# EAGLE design ambisoniqueAlim (EAGLE 7.6.0)
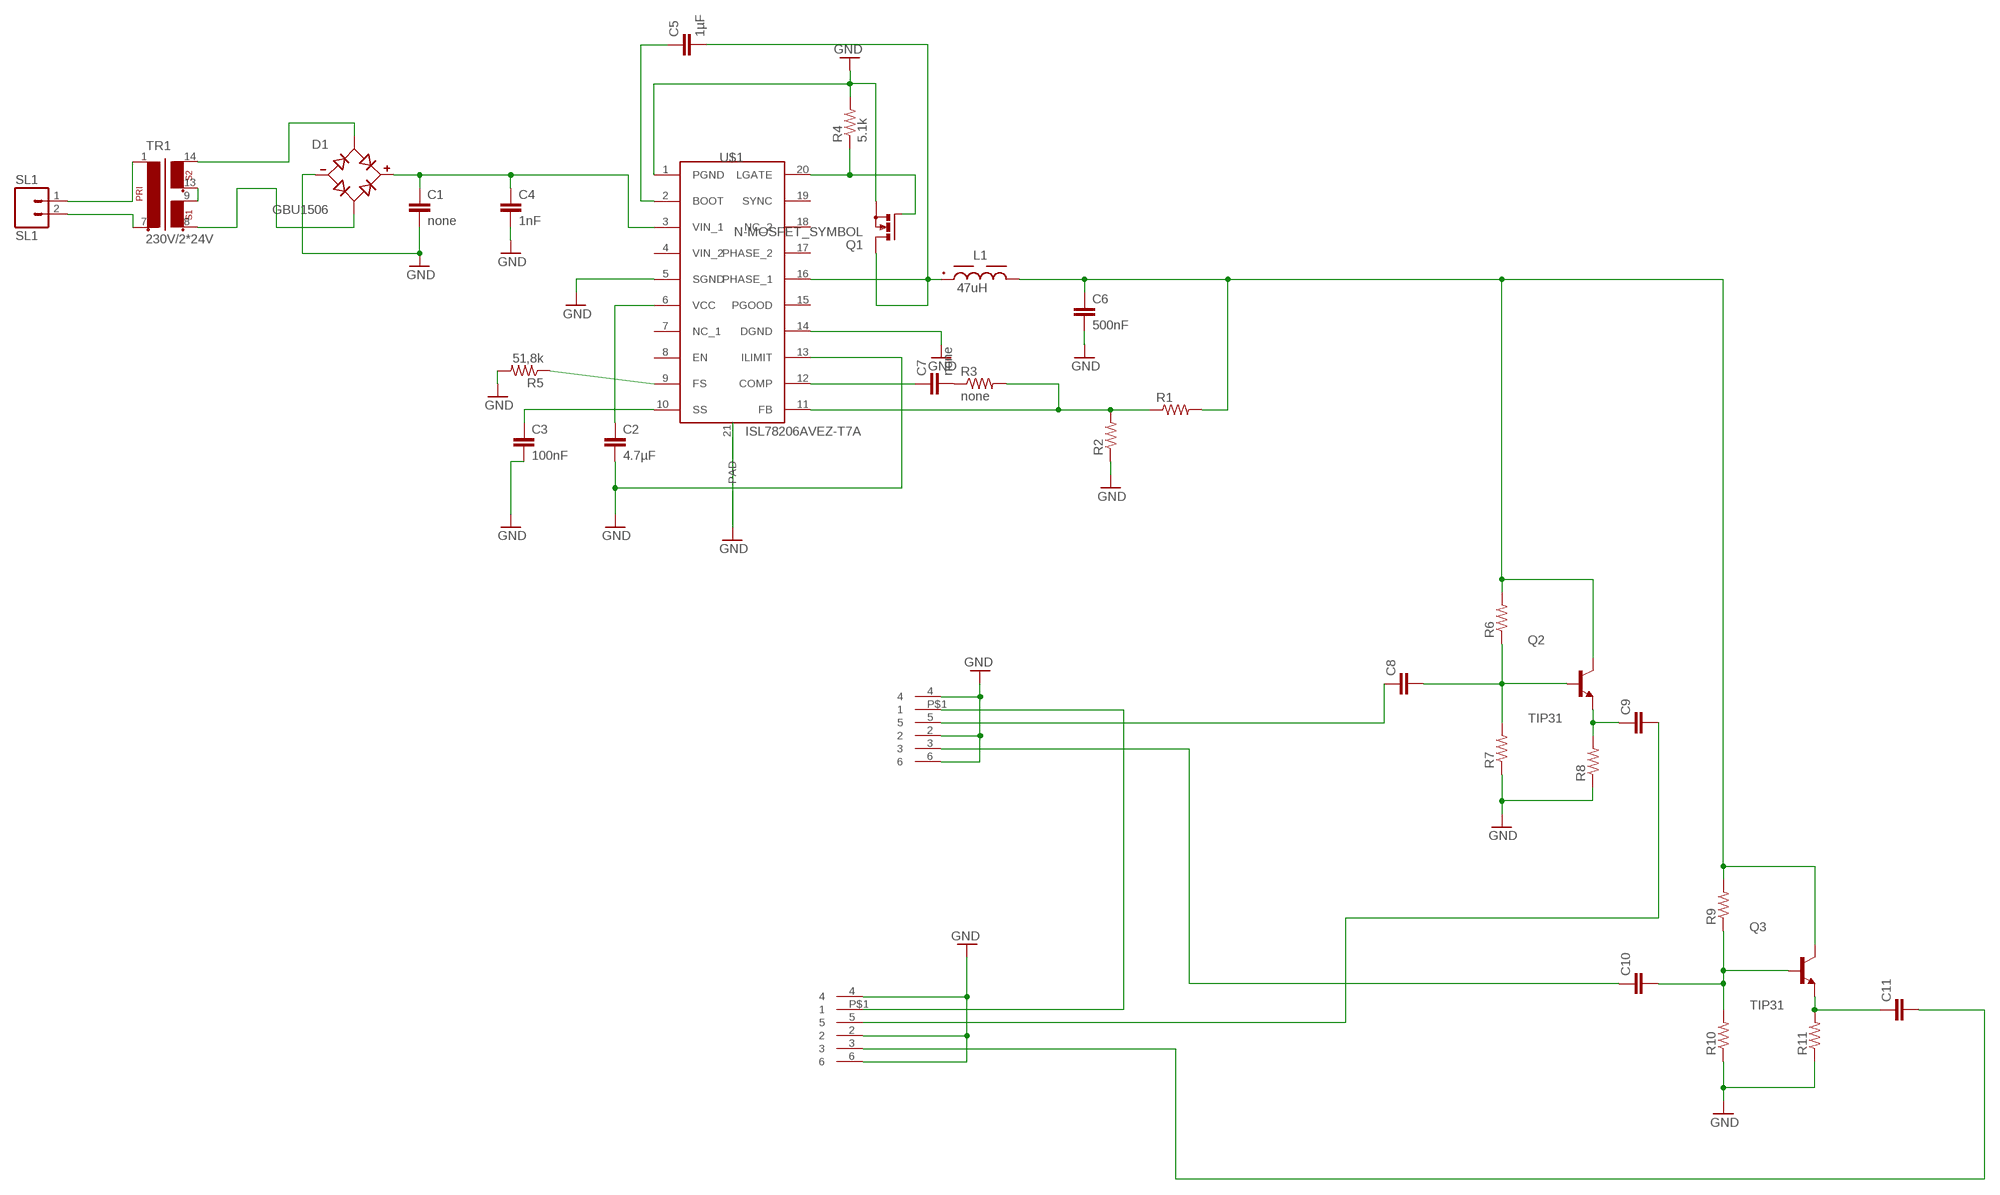
[diagram p0: schematic, sheet 1]

## Parts
C1  none  C-EUC0603  [C0603]
C2  4.7µF  C-EUC0603  [C0603]
C3  100nF  C-EUC0603  [C0603]
C4  1nF  C-EUC0603  [C0603]
C5  1µF  C-EUC0603  [C0603]
C6  500nF  C-EUC0603  [C0603]
C7  none  C-EUC0603  [C0603]
C8  C-EUC0603  [C0603]
C9  C-EUC0603  [C0603]
C10  C-EUC0603  [C0603]
C11  C-EUC0603  [C0603]
D1  GBU1506  [SIP343W114P508L2205H2134Q4]
L1  47uH  WE-PDA_1210_7847709470  [WE-PDA_1210]
Q2  TIP31  [TO254P1060X482X2222-3]
Q3  TIP31  [TO254P1060X482X2222-3]
R1  R-US_R0603  [R0603]
R2  R-US_R0603  [R0603]
R3  none  R-US_R0603  [R0603]
R4  5.1k  R-US_R0603  [R0603]
R5  51,8k  R-US_R0603  [R0603]
R6  R-US_R0603  [R0603]
R7  R-US_R0603  [R0603]
R8  R-US_R0603  [R0603]
R9  R-US_R0603  [R0603]
R10  R-US_R0603  [R0603]
R11  R-US_R0603  [R0603]
SL1  SL1  M02  [02P]
TR1  230V/2*24V  EI60-2  [EI60-2]
U$1  ISL78206AVEZ-T7A  [SOP65P640X110-21N]
U$2  JACK6.35MMRSPRODEV  [JACKRSPRO6.35MM]
U$3  JACK6.35MMRSPRODEV  [JACKRSPRO6.35MM]

## Nets
GND: C1.2 C2.2 C3.2 C4.2 C6.2 D1.- R2.1 R4.2 R5.2 R7.1 R8.1 R10.1 R11.1 U$1.1(PGND) U$1.5(SGND) U$1.13(ILIMIT) U$1.14(DGND) U$1.21(PAD) U$2.2 U$2.4 U$2.6 U$3.2 U$3.4 U$3.6
N$1: TR1.9 TR1.13
N$2: D1.AC1 TR1.14
N$3: C2.1 U$1.6(VCC)
N$4: SL1.1 TR1.1
N$5: SL1.2 TR1.7
N$6: D1.AC2 TR1.8
N$7: U$2.P$1 U$3.P$1
N$8: C1.1 C4.1 D1.+ U$1.3(VIN_1)
N$9: C3.1 U$1.10(SS)
N$10: C5.1 U$1.2(BOOT)
N$11: C10.2 Q3.1(B) R9.1 R10.2
N$12: C9.1 Q2.3(E) R8.2
N$13: R1.1 R2.2 R3.2 U$1.11(FB)
N$14: C7.1 U$1.12(COMP)
N$15: C7.2 R3.1
N$16: R5.1 U$1.9(FS)
N$17: R4.1 U$1.20(LGATE)
N$18: C8.2 Q2.1(B) R6.1 R7.2
N$19: C9.2 U$3.5
N$20: C11.1 Q3.3(E) R11.2
N$21: C6.1 L1.2 Q2.2(C) Q3.2(C) R1.2 R6.2 R9.2
N$22: C5.2 L1.1 U$1.16(PHASE_1)
N$23: C11.2 U$3.3
N$24: C10.1 U$2.3
N$25: C8.1 U$2.5
Unconnected: U$1.4(VIN_2) U$1.7(NC_1) U$1.8(EN) U$1.15(PGOOD) U$1.17(PHASE_2) U$1.18(NC_2) U$1.19(SYNC)

## Library data of the parts
C1-C11 = rcl:C-EU: CAPACITOR, European symbol
D1 = GBU1506:GBU1506: Check availability <https://pricing.snapeda.com/parts/GBU1506/Taiwan%20Semiconductor%20Corporation/view-part?ref=eda>; AVAILABILITY: In Stock; DESCRIPTION: 15A, 800V, Standard Bridge Rectifier; MF: Taiwan Semiconductor Corporation; MP: GBU1506; PACKAGE: GBU Taiwan Semiconductor; PRICE: None
L1 = Eagle_WE-PDA (rev20b):WE-PDA_1210: WE-PDA SMD Shielded Power Inductor Characteristics Magnetically shielded version which results in a low leakage field High storage capacity High Saturation currents up to 23 A Very low self-losses at high switching frequency's Wide inductance spectrum available at all sizes Operating Temperature -40 °C up to +125 °C Core Material: NiZn Wire connection: welding technology Applications Multimedia applications Switching regulators with low operating voltages Integrated DC/DC-converter Perfect suitable for switching regulators with extremely high efficiency (> 86 %) Plastic base: Because of the one piece construction these are more suitable for high vibration or shock applications <https://www.we-online.com/catalog/media/o55118v209%20Family_WE-PDA.jpg> Details see: https://www.we-online.com/katalog/en/WE-PDA Updated by Ella Wu 2020-03-18 2020(C) Wurth Elektronik; DATASHEET-URL: https://www.we-online.com/catalog/datasheet/7847709470.pdf; FRES: 6.3MHz; IR: 3.2A; ISAT: 3.5A; MOUNT: SMT; PART-NUMBER: 7847709470; RDC-MAX: 67mOhm; RDC-TYP: 56mOhm
Q2 Q3 = TIP31:TIP31: Bipolar (BJT) Transistor NPN 40V 3A 3MHz 2W Through Hole TO-220AB Check availability <https://pricing.snapeda.com/parts/TIP31/ON/view-part?ref=eda>; AVAILABILITY: In Stock; DESCRIPTION: Bipolar (BJT) Transistor NPN 100 V 3 A 3MHz 2 W Through Hole TO-220; MF: ON; MP: TIP31; PACKAGE: TO-220-3 ON Semiconductor; PRICE: None; PURCHASE-URL: https://pricing.snapeda.com/search/part/TIP31/?ref=eda
R1-R11 = rcl:R-US_: RESISTOR, American symbol
SL1 = con-amp-quick:M02: AMP QUICK CONNECTOR; OC_FARNELL: unknown; OC_NEWARK: unknown
TR1 = trafo:EI60-2: TRANSFORMER 1 primary winding, 2 secondary windings, mounting holes ERA
U$1 = SOP65P640X110-21N:ISL78206AVEZ-T7A
U$2 U$3 = jackRSpro6.35mm:JACK6.35MMRSPRODEV

## Board
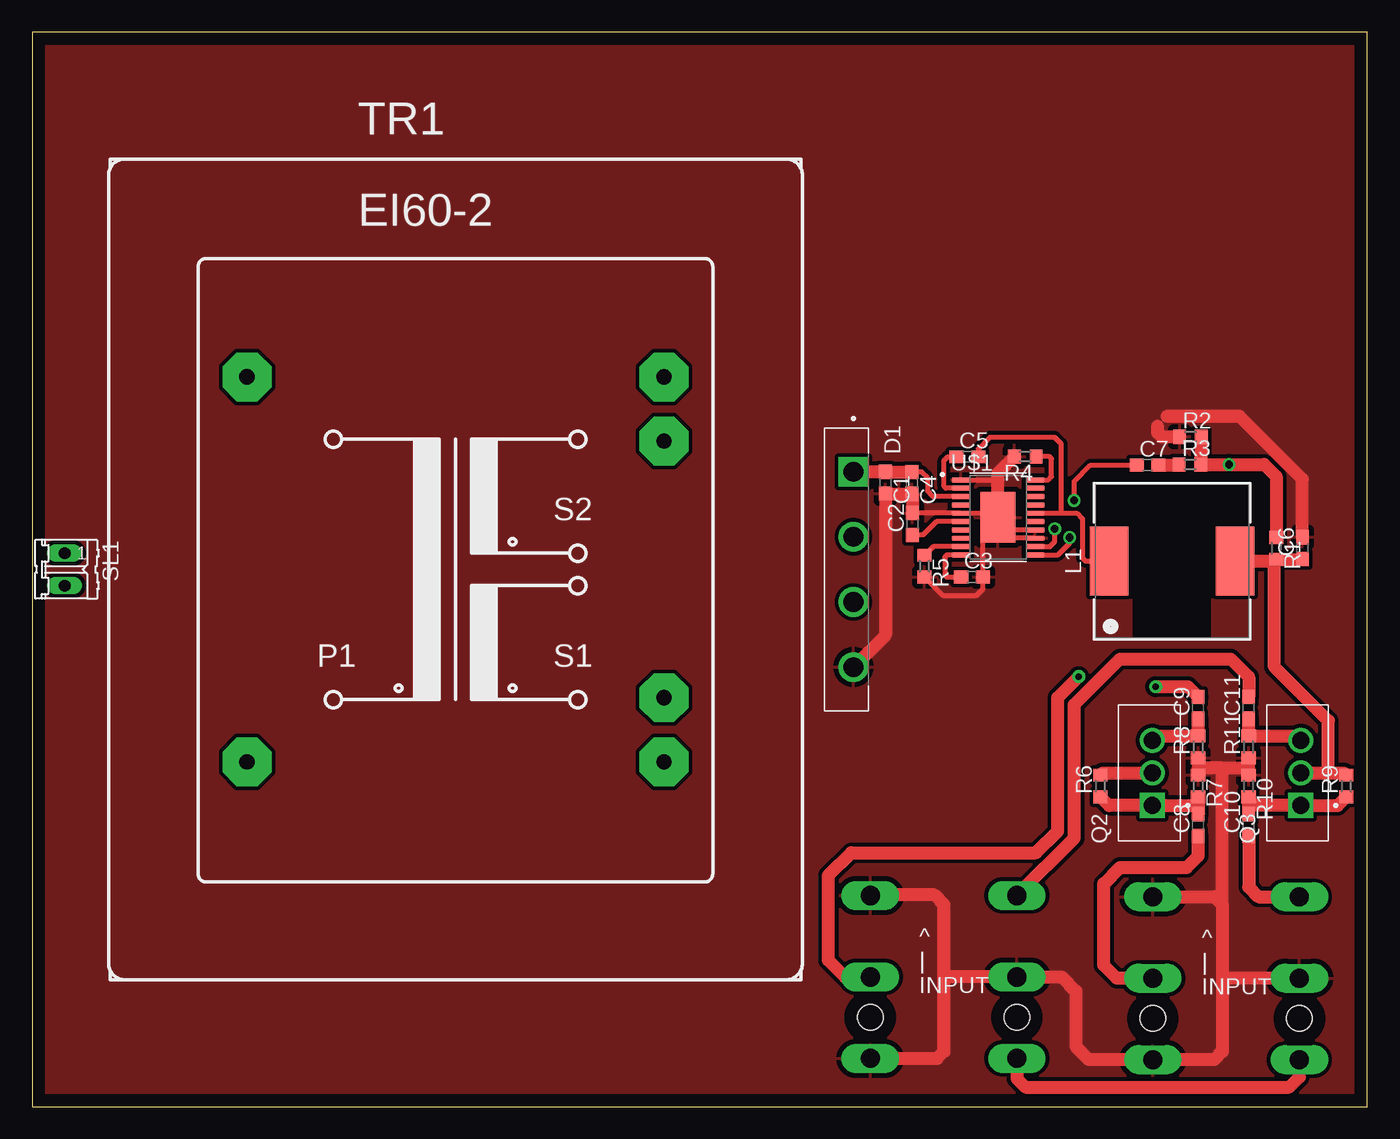
[diagram p1: board, top side]
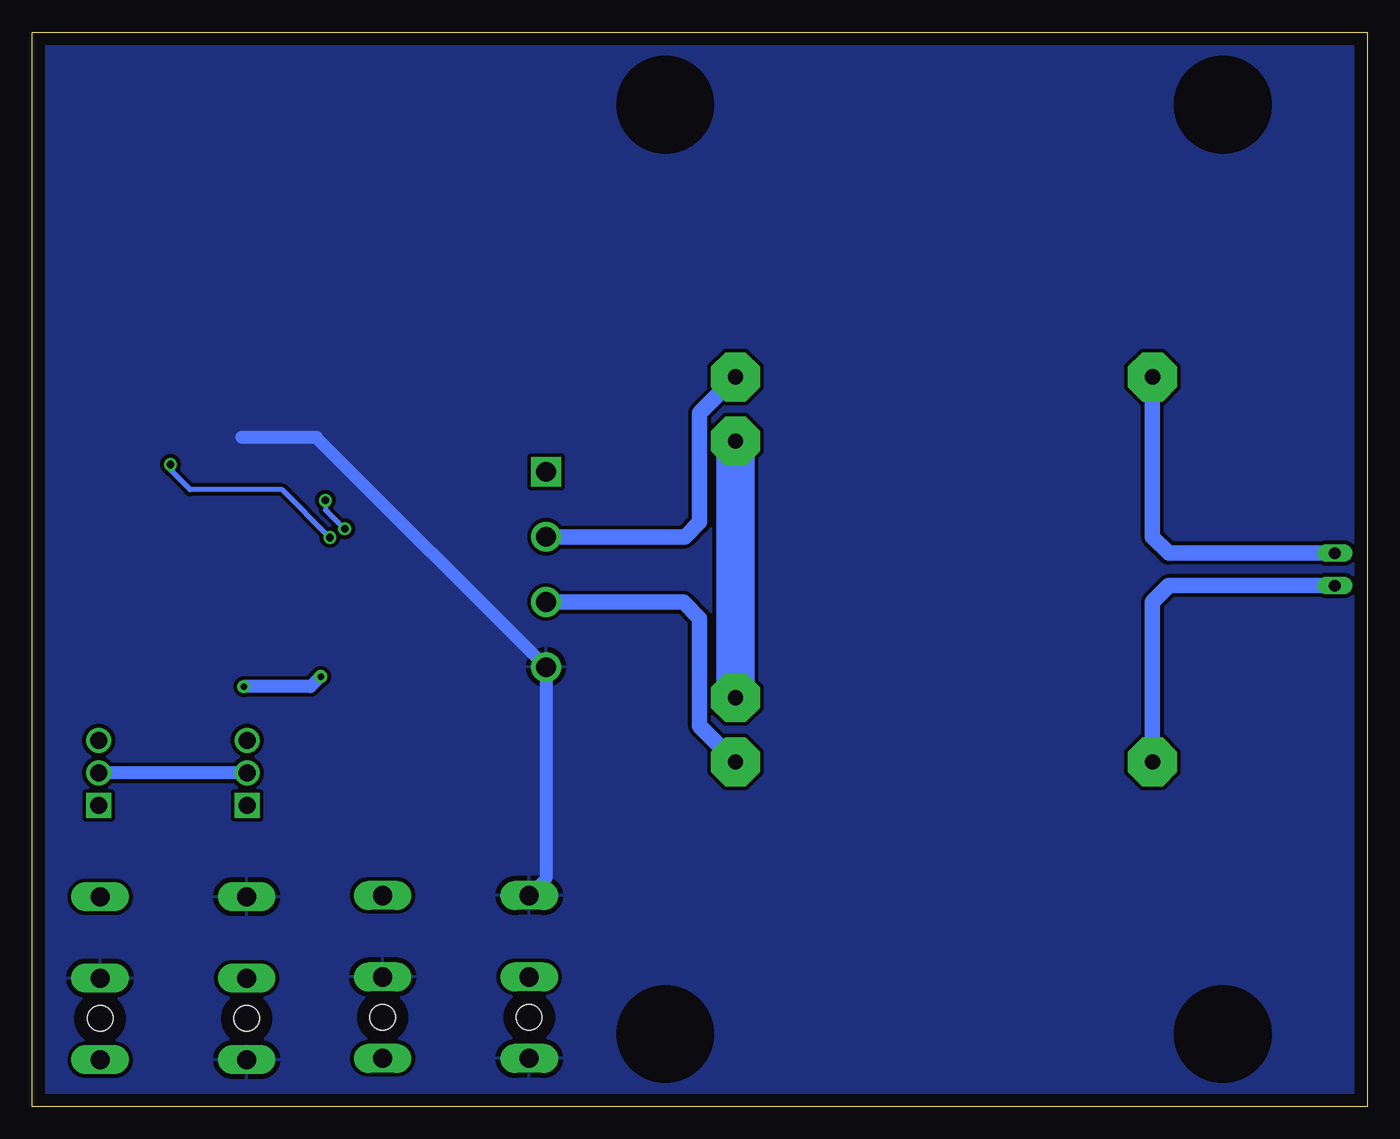
[diagram p2: board, bottom side, seen from below]

Size 104.14 x 83.82 mm. Coordinates in mm from the lower left corner, seen from the top.
Outline: 0,0 104.14,0 104.14,83.82 0,83.82 0,0
Copper layers (1*16): Top 0.035mm / dielectric 1.5mm / Bottom 0.035mm
Design rules "ENSEA_2022_04_08 *": minimum track width 0.2mm, minimum drill 0.6mm, track to track 0.3mm, track to pad 0.5mm, pad to pad 0.3mm, via to via 0.3mm, smd to smd 0.3mm, copper to edge 1mm, drill to drill 0.4mm, minimum pad ring 0.2mm, minimum via ring 0.2mm, stop-mask expansion 4mil, vias tented up to drill 0mil, thermal gap 0.4mm

### Footprints (pad centres in the part's own frame; a part is rotated, then mirrored left to right if it is on the bottom)
C0603 = smd 1.1 x 1: 1 -0.85,0; 2 0.85,0
SIP343W114P508L2205H2134Q4 = drill 1.54 square: + -7.62,0.56 | drill 1.54: - 7.62,0.56; AC1 -2.54,0.56; AC2 2.54,0.56
WE-PDA_1210 = smd 5.4 x 3: 1 0,4.9; 2 0,-4.9
TO254P1060X482X2222-3 = drill 1.31 square: 1 -2.54,0 | drill 1.31: 2 0,0; 3 2.54,0
R0603 = smd 1 x 1.1: 1 -0.85,0; 2 0.85,0
02P = drill 0.914 long: 1 -1.27,0; 2 1.27,0
EI60-2 = drill 1.194 pad 3.81 octagon: 1 -16.256,15.011; 7 -16.256,-15.011; 8 16.256,-15.011; 9 16.256,-10.008; 13 16.256,10.008; 14 16.256,15.011
SOP65P640X110-21N = smd 1.46 x 0.41: 1 -2.885,2.925; 2 -2.885,2.275; 3 -2.885,1.625; 4 -2.885,0.975; 5 -2.885,0.325; 6 -2.885,-0.325; 7 -2.885,-0.975; 8 -2.885,-1.625; 9 -2.885,-2.275; 10 -2.885,-2.925; 11 2.885,-2.925; 12 2.885,-2.275; 13 2.885,-1.625; 14 2.885,-0.975; 15 2.885,-0.325; 16 2.885,0.325; 17 2.885,0.975; 18 2.885,1.625; 19 2.885,2.275; 20 2.885,2.925 | smd 2.743 x 3.937: 21 0,0
JACKRSPRO6.35MM = drill 1.5 long: 2 -2.54,2.54; 3 -8.89,2.54; 4 3.81,-8.89; 5 -2.54,-8.89; 6 -8.89,-8.89; P$1 3.81,2.54 | hole 2: 0.6,2.54; 0.6,-8.89

### Placement (x,y rotation side)
C1  66.54,48.67 270 top
C2  68.65,45.44 90 top
C3  73.31,41.32 0 top
C4  68.62,48.66 270 top
C5  72.94,50.69 0 top
C6  99.07,43.57 90 top
C7  87,50.04 0 top
C8  90.93,21.97 90 top
C9  90.93,31.11 90 top
C10  94.87,21.97 90 top
C11  94.87,31.11 90 top
D1  63.5,41.91 270 top
L1  88.9,42.56 90 top
Q2  87.38,26.04 90 top
Q3  98.93,26.04 90 top
R1  97.02,43.55 270 top
R2  90.34,52.25 0 top
R3  90.3,50.09 0 top
R4  77.45,50.71 180 top
R5  69.6,42.16 270 top
R6  83.31,25.02 90 top
R7  90.93,25.02 270 top
R8  90.93,28.07 90 top
R9  102.49,25.02 90 top
R10  94.87,25.02 270 top
R11  94.87,28.07 90 top
SL1  2.54,41.91 270 top
TR1  33.02,41.91 0 top
U$1  75.33,45.97 0 top
U$2  96.29,7.49 270 top
U$3  74.26,7.58 270 top

### Tracks (layer width: path | path; a pad name or v marks a point on that pad's centre or on a via)
GND
  Top 0.4: C2.2 U$1.5 75,46.29 U$1.21 | 75.82,44.32 75.84,44.34 75.33,44.85 U$1.21 | C3.2 74.16,41.53 | 74.16,41.53 74.16,44.8 U$1.21 | U$1.1 75.32,48.89 75.33,48.9 | R5.2 71.03,39.88 73.66,39.88 74.17,40.39 74.17,41.52 74.16,41.53 | U$1.21 75.33,45.77 | U$1.14 76.3,44.99 U$1.21 | U$1.13 75.56,44.34 75.33,44.57 U$1.21
  Top 1: R8.1 90.93,26.42 | 90.93,26.42 R7.1 | R10.1 94.87,26.42 | 94.87,26.42 R11.1 | U$3.4 70.58,3.77 71.12,4.32 71.12,10.12 | 71.12,10.12 U$3.2 80.3,10.12 81.41,9.02 81.41,4.7 82.43,3.67 U$2.4 92.19,3.67 92.84,4.32 92.84,10.03 | U$3.6 65.41,16.51 70.36,16.51 71.12,15.75 71.12,10.12 | U$2.6 92.21,16.38 92.84,15.75 | 92.84,15.75 92.84,10.03 | U$2.2 92.84,10.03 | 92.84,15.75 92.84,26.42 | 92.84,26.42 90.93,26.42 | 92.84,26.42 94.87,26.42 | D1.- 66.55,36.78 C1.2 66.56,47.81 C4.2 68.64,47.78 C2.2 | U$1.21 75.33,48.9 75.33,49.44 R4.2 | C6.2 99.07,48.94 94.17,53.85 88.52,53.85 | 87.76,53.09 87.76,52.58 88.08,52.25 R2.1
  Bottom 1: U$3.6 64.06,17.79 D1.- 81.97,52.2 87.76,52.2
  pour Bottom: 0,0 104.14,0 104.14,83.82 0,83.82
  pour Top: 0,0 104.14,0 104.14,83.82 0,83.82
N$1
  Bottom 3: TR1.9 TR1.13
N$2
  Bottom 1.2: D1.AC1 53.22,44.45 52.08,45.59 52.08,54.12 TR1.14
N$3
  Top 0.4: U$1.6 70.53,45.64 69.49,44.59 C2.1
N$4
  Bottom 1.2: SL1.1 15.49,43.18 16.76,44.45 TR1.1
N$5
  Bottom 1.2: SL1.2 15.49,40.64 16.76,39.37 TR1.7
N$6
  Bottom 1.2: D1.AC2 53.35,39.37 52.08,38.1 52.08,29.7 TR1.8
N$7
  Top 1: U$3.P$1 76.8,2.19 77.47,1.52 98.04,1.52 98.83,2.31 U$2.P$1
N$8
  Top 0.4: U$1.3 70.27,47.59 69.85,48.01 69.85,49.02 69.37,49.51 C4.1
  Top 1: D1.+ C1.1 68.6,49.52 C4.1
N$9
  Top 0.4: U$1.10 71.36,43.04 71.18,42.86 71.18,41.47 71.33,41.32 C3.1
N$10
  Top 0.4: U$1.2 71.27,48.24 71.12,48.39 71.12,50.42 71.39,50.69 C5.1
N$11
  Top 1: C10.2 94.87,23.37 | 94.87,23.37 R10.2 | 94.87,23.37 95,23.5 Q3.1 101.81,23.5 R9.1
N$12
  Top 1: C9.1 R8.2 87.72,28.92 Q2.3
N$13  (via drill 0.6)
  Top 0.4: U$1.11 80,43.04 80.92,43.96 v80.92,44.41
  Top 1: R2.2 91.19,50.14 R3.2 v93.34,50.09 96.08,50.09 97.02,49.16 R1.1
  Bottom 0.4: v80.92,44.41 84.64,48.13 91.82,48.13 93.34,49.66 v93.34,50.09
N$14  (via drill 0.6)
  Top 0.4: U$1.12 79.38,43.69 79.76,44.07 v79.76,45.09 | v81.26,47.29 81.28,47.31 81.28,48.77 82.55,50.04 C7.1
  Bottom 0.4: v79.76,45.09 79.82,45.09 81.26,46.53 v81.26,47.29
N$15
  Top 1: C7.2 89.39,50.04 R3.1
N$16
  Top 0.4: U$1.9 70.27,43.69 R5.1
N$17
  Top 0.4: U$1.20 79.24,48.89 79.5,49.15 79.5,50.55 79.34,50.71 R4.1
N$18
  Top 1: R7.2 90.93,23.37 | 90.93,23.37 C8.2 | 90.93,23.37 90.81,23.5 Q2.1 83.99,23.5 R6.1
N$19  (via drill 0.5 pad 1)
  Top 1: U$3.5 63.41,10.12 62.1,11.43 62.1,18.03 63.88,19.81 78.3,19.81 79.98,21.49 79.98,31.91 v81.63,33.56 | v87.63,32.77 90.13,32.77 C9.2
  Bottom 1: v81.63,33.56 82.42,32.77 v87.63,32.77
N$20
  Top 1: C11.1 R11.2 98.59,28.92 Q3.3
N$21
  Top 1: R6.2 83.48,26.04 Q2.2 | Q3.2 101.09,26.04 | 101.09,26.04 102.32,26.04 R9.2 | L1.2 96.88,42.56 | 96.88,42.56 R1.2 99.05,42.7 C6.1 | 101.09,26.04 101.09,30.1 96.88,34.31 96.88,42.56
  Bottom 1: Q2.2 Q3.2
N$22
  Top 0.4: U$1.16 80.26,46.29 | 80.26,46.29 81.47,46.29 81.92,45.85 81.92,42.8 82.15,42.56 L1.1 | 80.26,46.29 80.26,51.69 79.76,52.2 74.68,52.2 73.79,51.31 C5.2
N$23
  Top 1: U$3.3 81.28,20.95 81.28,31.37 84.84,34.92 93.47,34.92 94.87,33.53 C11.2
N$24
  Top 1: C10.1 94.87,17.14 95.64,16.38 U$2.3
N$25
  Top 1: U$2.5 84.59,10.03 83.57,11.05 83.57,17.4 84.84,18.67 90.04,18.67 90.93,19.56 C8.1